# Altium schematic sheet LDO_Sheet.SchDoc
size A; SheetNumber: 5; SheetTotal: 7
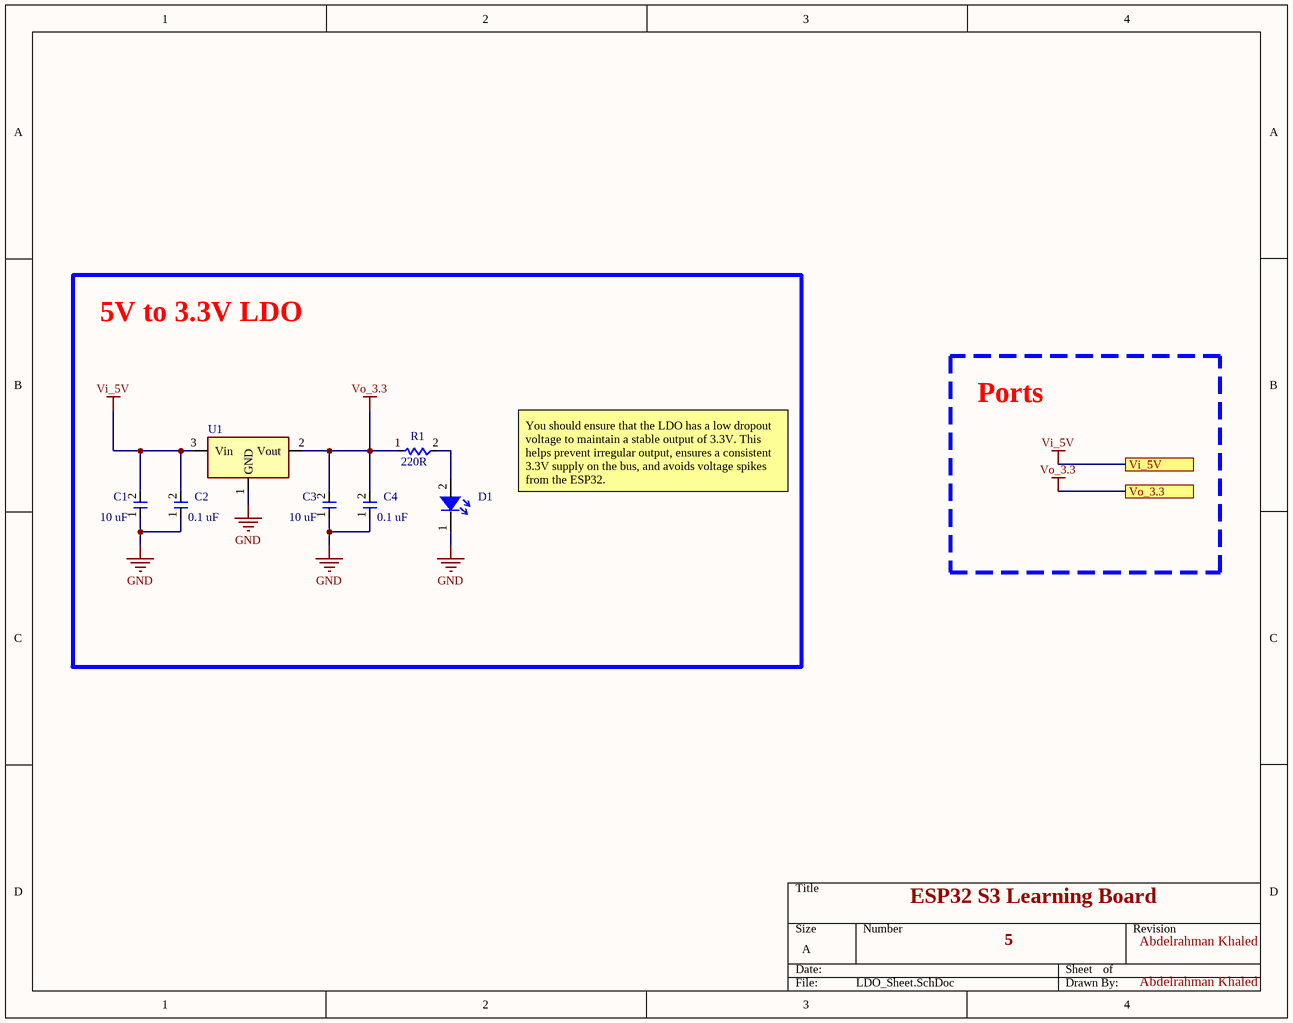
[diagram p0: LDO_Sheet.SchDoc]

## Parts
C1  10 uF  [Capacitor]
C2  0.1 uF  [Capacitor]
C3  10 uF  [Capacitor]
C4  0.1 uF  [Capacitor]
D1  Red Led  [Led]  (value not drawn)
R1  220R  [Resistor]
U1  Regulator LDO 3.3V  [Regulator 3.3V]  (value not drawn)

## Blocks framed on the sheet
5V to 3.3V LDO: C1-C4 D1 R1 U1

## Ports
Vi_5V (see Block Diagram[4B], Microcontroller_ESP32_S3[4D], RGB_Logical_Shifter_Sheet[4A], USB_Communication_Sheet[4B], USB_UART_Converter[4A]), Vo_3.3 (see Block Diagram[4B], Microcontroller's_Prephirals_Sheet[4A], RGB_Logical_Shifter_Sheet[4A], USB_UART_Converter[4A])

## Nets
GND: C1.1(Pin_1) C2.1(Pin_1) C3.1(Pin_1) C4.1(Pin_1) D1.1 U1.1(GND)
Vi_5V: C1.2(Pin_2) C2.2(Pin_2) U1.3(Vin) ; port Vi_5V
Vo_3.3: C3.2(Pin_2) C4.2(Pin_2) R1.1(Pin_1) U1.2(Vout) ; port Vo_3.3
NetD1_2: D1.2 R1.2(pin_2)

## Notes on the sheet
- Ports
- You should ensure that the LDO has a low dropout voltage to maintain a stable output of 3.3V. This helps prevent irregular output, ensures a consistent 3.3V supply on the bus, and avoids voltage spikes from the ESP32.
- ESP32 S3 Learning Board
- 5
- Abdelrahman Khaled

## Library data of the parts
C1-C4 = Capacitor
D1 = LED: https://www.digikey.com/en/products/detail/yongyu-optoelectronics/YY0402BL-NN3S0-T1AR4/25558564?s=N4IgjCBcoLQCxVAYygMwIYBsDOBTANCAPZQDaIAnAMxhwQC6AvoTAGyIgqQAuATgK4FiZEFRBNmIAEwiqAOioA1AAQB5AHLKAMgFEAIuMZA
R1 = Resistance